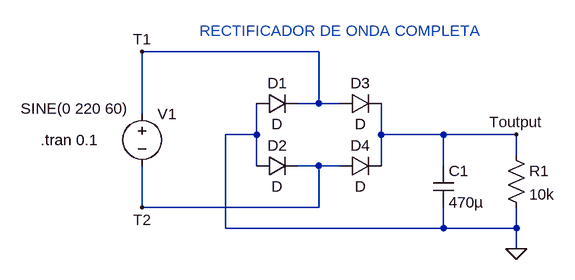
[diagram p0: schematic RECTIFICADOR ONDA COMPLETA.asc]
RECTIFICADOR ONDA COMPLETA.asc, the LTspice schematic file:
Version 4
SHEET 1 880 680
WIRE 224 48 -48 48
WIRE 224 128 224 48
WIRE 224 128 192 128
WIRE 256 128 224 128
WIRE -48 144 -48 48
WIRE 128 176 128 128
WIRE 128 176 80 176
WIRE 320 176 320 128
WIRE 416 176 320 176
WIRE 528 176 416 176
WIRE 528 208 528 176
WIRE 128 224 128 176
WIRE 224 224 192 224
WIRE 256 224 224 224
WIRE 320 224 320 176
WIRE 416 224 416 176
WIRE -48 288 -48 224
WIRE 224 288 224 224
WIRE 224 288 -48 288
WIRE 80 320 80 176
WIRE 416 320 416 288
WIRE 416 320 80 320
WIRE 528 320 528 288
WIRE 528 320 416 320
WIRE 528 352 528 320
FLAG 528 352 0
FLAG -48 48 T1
FLAG -48 288 T2
FLAG 528 176 Toutput
SYMBOL voltage -48 128 R0
WINDOW 3 -187 8 Left 2
WINDOW 123 -187 36 Left 2
WINDOW 39 0 0 Left 0
SYMATTR InstName V1
SYMATTR Value SINE(0 220 60)
SYMBOL diode 128 144 R270
WINDOW 0 32 32 VTop 2
WINDOW 3 0 32 VBottom 2
SYMATTR InstName D1
SYMBOL diode 128 240 R270
WINDOW 0 32 32 VTop 2
WINDOW 3 0 32 VBottom 2
SYMATTR InstName D2
SYMBOL diode 256 144 R270
WINDOW 0 32 32 VTop 2
WINDOW 3 0 32 VBottom 2
SYMATTR InstName D3
SYMBOL diode 256 240 R270
WINDOW 0 32 32 VTop 2
WINDOW 3 0 32 VBottom 2
SYMATTR InstName D4
SYMBOL cap 400 224 R0
SYMATTR InstName C1
SYMATTR Value 470µ
SYMBOL res 512 192 R0
SYMATTR InstName R1
SYMATTR Value 10k
TEXT -204 184 Left 2 !.tran 0.1
TEXT 40 16 Left 2 ;RECTIFICADOR DE ONDA COMPLETA

The netlist it stands for:
* RECTIFICADOR ONDA COMPLETA.asc
V1 T1 T2 SINE(0 220 60)
D1 0 T1 D
D2 0 T2 D
D3 T1 Toutput D
D4 T2 Toutput D
C1 Toutput 0 470µ
R1 Toutput 0 10k
.model D D
.lib standard.dio
.tran 0.1
* RECTIFICADOR DE ONDA COMPLETA
.backanno
.end